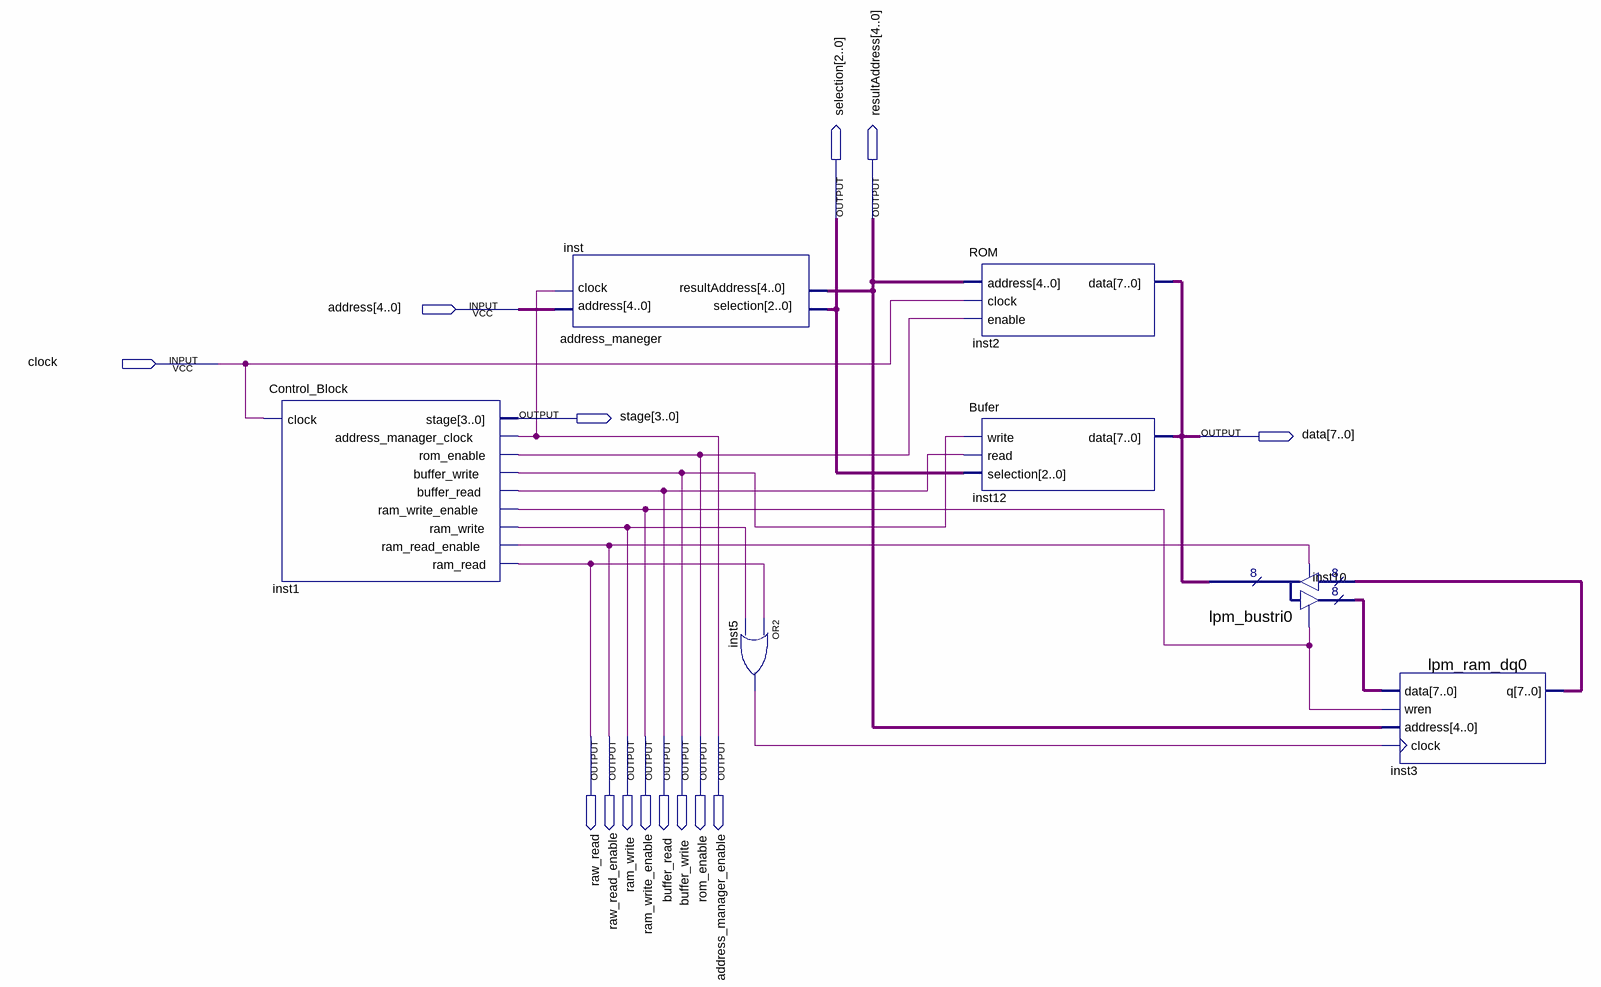
[diagram p0: schematic sheet]
// Quartus schematic main.bdf as structural Verilog: 7 symbols, 14 pins
module main (
  input  [4:0] address,
  input  clock,
  output [2:0] selection,
  output [4:0] resultAddress,
  output [3:0] stage,
  output [7:0] data,
  output raw_read,
  output raw_read_enable,
  output ram_write,
  output ram_write_enable,
  output buffer_read,
  output buffer_write,
  output rom_enable,
  output address_manager_enable
);

  wire inst5_out;
  wire [7:0] inst3_q, inst10_result;

  Control_Block inst1 (
    .clock(clock), .stage(stage), .address_manager_clock(address_manager_enable), .rom_enable(rom_enable),
    .buffer_write(buffer_write), .buffer_read(buffer_read), .ram_write_enable(ram_write_enable),
    .ram_write(ram_write), .ram_read_enable(raw_read_enable), .ram_read(raw_read));
  address_maneger inst (
    .address(address), .clock(address_manager_enable), .selection(selection), .resultAddress(resultAddress));
  or inst5 (inst5_out, raw_read, ram_write);
  ROM inst2 (.address(resultAddress), .clock(clock), .enable(rom_enable), .data(data));
  Bufer inst12 (.write(buffer_write), .read(buffer_read), .selection(selection), .data(data));
  lpm_bustri0 inst10 (
    .enabledt(raw_read_enable), .data(inst3_q), .enabletr(ram_write_enable), .result(inst10_result),
    .tridata(data));
  lpm_ram_dq0 inst3 (
    .data(inst10_result), .wren(ram_write_enable), .address(resultAddress), .clock(inst5_out), .q(inst3_q));
endmodule
